# EasyEDA Pro project ProPrj_MN42_2025-04-03.epro, schematic btnBRD
Board Name: btnBRD; Create Date: 2025-04-03; Page Name: btnBRD; Project Name: MN42; Schematic Name: btnBRD; Update Date: 2025-04-03; File: btnBRD; Id: /; Sheet: /
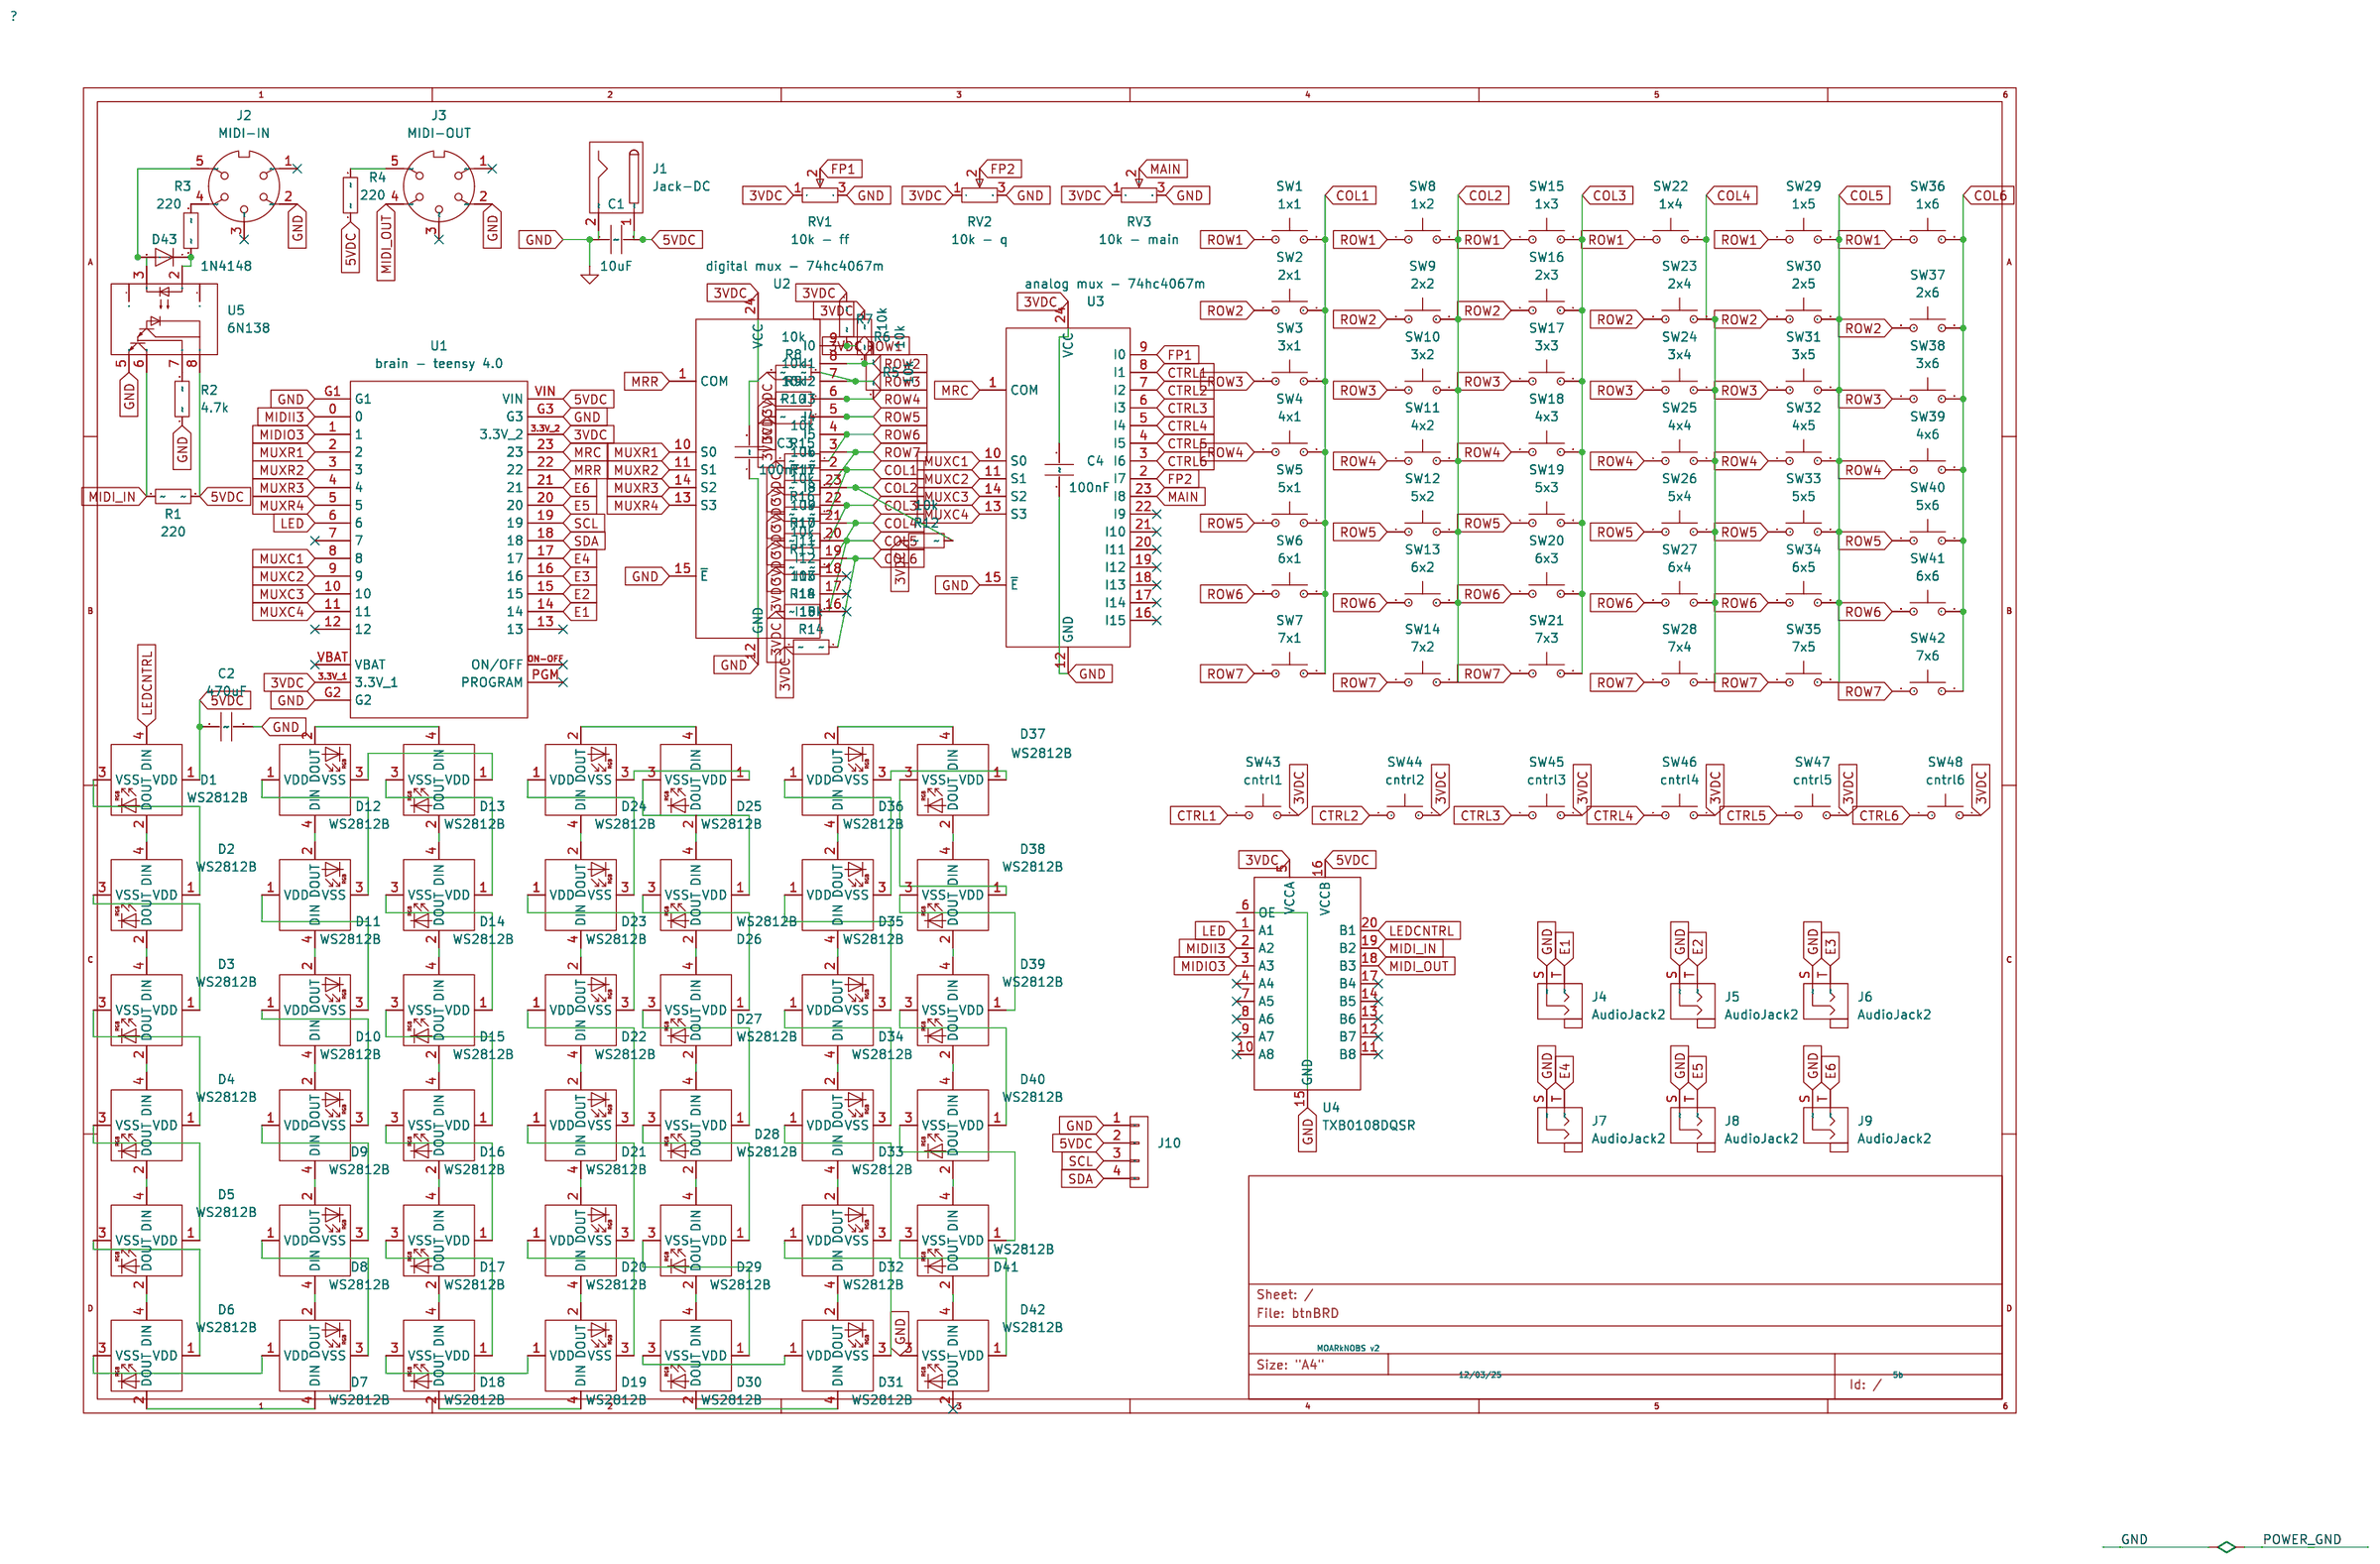
[diagram p0: schematic sheet]

## Parts
C1  10uF  [Capacitor_THT:C_Disc_D3.4mm_W2.1mm_P2.50mm]
C2  470uF  [Capacitor_THT:C_Disc_D3.4mm_W2.1mm_P2.50mm]
C3  100nF  [Capacitor_THT:C_Disc_D3.4mm_W2.1mm_P2.50mm]
C4  100nF  [Capacitor_THT:C_Disc_D3.4mm_W2.1mm_P2.50mm]
D1  WS2812B  [LED_SMD:LED_WS2812B_PLCC4_5.0x5.0mm_P3.2mm]
D2  WS2812B  [LED_SMD:LED_WS2812B_PLCC4_5.0x5.0mm_P3.2mm]
D3  WS2812B  [LED_SMD:LED_WS2812B_PLCC4_5.0x5.0mm_P3.2mm]
D4  WS2812B  [LED_SMD:LED_WS2812B_PLCC4_5.0x5.0mm_P3.2mm]
D5  WS2812B  [LED_SMD:LED_WS2812B_PLCC4_5.0x5.0mm_P3.2mm]
D6  WS2812B  [LED_SMD:LED_WS2812B_PLCC4_5.0x5.0mm_P3.2mm]
D7  WS2812B  [LED_SMD:LED_WS2812B_PLCC4_5.0x5.0mm_P3.2mm]
D8  WS2812B  [LED_SMD:LED_WS2812B_PLCC4_5.0x5.0mm_P3.2mm]
D9  WS2812B  [LED_SMD:LED_WS2812B_PLCC4_5.0x5.0mm_P3.2mm]
D10  WS2812B  [LED_SMD:LED_WS2812B_PLCC4_5.0x5.0mm_P3.2mm]
D11  WS2812B  [LED_SMD:LED_WS2812B_PLCC4_5.0x5.0mm_P3.2mm]
D12  WS2812B  [LED_SMD:LED_WS2812B_PLCC4_5.0x5.0mm_P3.2mm]
D13  WS2812B  [LED_SMD:LED_WS2812B_PLCC4_5.0x5.0mm_P3.2mm]
D14  WS2812B  [LED_SMD:LED_WS2812B_PLCC4_5.0x5.0mm_P3.2mm]
D15  WS2812B  [LED_SMD:LED_WS2812B_PLCC4_5.0x5.0mm_P3.2mm]
D16  WS2812B  [LED_SMD:LED_WS2812B_PLCC4_5.0x5.0mm_P3.2mm]
D17  WS2812B  [LED_SMD:LED_WS2812B_PLCC4_5.0x5.0mm_P3.2mm]
D18  WS2812B  [LED_SMD:LED_WS2812B_PLCC4_5.0x5.0mm_P3.2mm]
D19  WS2812B  [LED_SMD:LED_WS2812B_PLCC4_5.0x5.0mm_P3.2mm]
D20  WS2812B  [LED_SMD:LED_WS2812B_PLCC4_5.0x5.0mm_P3.2mm]
D21  WS2812B  [LED_SMD:LED_WS2812B_PLCC4_5.0x5.0mm_P3.2mm]
D22  WS2812B  [LED_SMD:LED_WS2812B_PLCC4_5.0x5.0mm_P3.2mm]
D23  WS2812B  [LED_SMD:LED_WS2812B_PLCC4_5.0x5.0mm_P3.2mm]
D24  WS2812B  [LED_SMD:LED_WS2812B_PLCC4_5.0x5.0mm_P3.2mm]
D25  WS2812B  [LED_SMD:LED_WS2812B_PLCC4_5.0x5.0mm_P3.2mm]
D26  WS2812B  [LED_SMD:LED_WS2812B_PLCC4_5.0x5.0mm_P3.2mm]
D27  WS2812B  [LED_SMD:LED_WS2812B_PLCC4_5.0x5.0mm_P3.2mm]
D28  WS2812B  [LED_SMD:LED_WS2812B_PLCC4_5.0x5.0mm_P3.2mm]
D29  WS2812B  [LED_SMD:LED_WS2812B_PLCC4_5.0x5.0mm_P3.2mm]
D30  WS2812B  [LED_SMD:LED_WS2812B_PLCC4_5.0x5.0mm_P3.2mm]
D31  WS2812B  [LED_SMD:LED_WS2812B_PLCC4_5.0x5.0mm_P3.2mm]
D32  WS2812B  [LED_SMD:LED_WS2812B_PLCC4_5.0x5.0mm_P3.2mm]
D33  WS2812B  [LED_SMD:LED_WS2812B_PLCC4_5.0x5.0mm_P3.2mm]
D34  WS2812B  [LED_SMD:LED_WS2812B_PLCC4_5.0x5.0mm_P3.2mm]
D35  WS2812B  [LED_SMD:LED_WS2812B_PLCC4_5.0x5.0mm_P3.2mm]
D36  WS2812B  [LED_SMD:LED_WS2812B_PLCC4_5.0x5.0mm_P3.2mm]
D37  WS2812B  [LED_SMD:LED_WS2812B_PLCC4_5.0x5.0mm_P3.2mm]
D38  WS2812B  [LED_SMD:LED_WS2812B_PLCC4_5.0x5.0mm_P3.2mm]
D39  WS2812B  [LED_SMD:LED_WS2812B_PLCC4_5.0x5.0mm_P3.2mm]
D40  WS2812B  [LED_SMD:LED_WS2812B_PLCC4_5.0x5.0mm_P3.2mm]
D41  WS2812B  [LED_SMD:LED_WS2812B_PLCC4_5.0x5.0mm_P3.2mm]
D42  WS2812B  [LED_SMD:LED_WS2812B_PLCC4_5.0x5.0mm_P3.2mm]
D43  1N4148  [Diode_THT:D_DO-35_SOD27_P7.62mm_Horizontal]
J1  Jack-DC  [Connector_BarrelJack:BarrelJack_GCT_DCJ200-10-A_Horizontal]
J2  MIDI-IN  [midiJack:KYCON_KCDX-5S-N]
J3  MIDI-OUT  [midiJack:KYCON_KCDX-5S-N]
J4  AudioJack2  [Connector_Audio:Jack_3.5mm_CUI_SJ1-3533NG_Horizontal]
J5  AudioJack2  [Connector_Audio:Jack_3.5mm_CUI_SJ1-3533NG_Horizontal]
J6  AudioJack2  [Connector_Audio:Jack_3.5mm_CUI_SJ1-3533NG_Horizontal]
J7  AudioJack2  [Connector_Audio:Jack_3.5mm_CUI_SJ1-3533NG_Horizontal]
J8  AudioJack2  [Connector_Audio:Jack_3.5mm_CUI_SJ1-3533NG_Horizontal]
J9  AudioJack2  [Connector_Audio:Jack_3.5mm_CUI_SJ1-3533NG_Horizontal]
J10  HS96L03W2C03  [OLED-TH_L27.8-W27.2-P2.54_C9900033791]
R1  220  [Resistor_THT:R_Axial_DIN0204_L3.6mm_D1.6mm_P2.54mm_Vertical]
R2  4.7k  [Resistor_THT:R_Axial_DIN0204_L3.6mm_D1.6mm_P2.54mm_Vertical]
R3  220  [Resistor_THT:R_Axial_DIN0204_L3.6mm_D1.6mm_P2.54mm_Vertical]
R4  220  [Resistor_THT:R_Axial_DIN0204_L3.6mm_D1.6mm_P2.54mm_Vertical]
R5  10k  [Resistor_THT:R_Axial_DIN0204_L3.6mm_D1.6mm_P2.54mm_Vertical]
R6  10k  [Resistor_THT:R_Axial_DIN0204_L3.6mm_D1.6mm_P2.54mm_Vertical]
R7  10k  [Resistor_THT:R_Axial_DIN0204_L3.6mm_D1.6mm_P2.54mm_Vertical]
R8  10k  [Resistor_THT:R_Axial_DIN0204_L3.6mm_D1.6mm_P2.54mm_Vertical]
R9  10k  [Resistor_THT:R_Axial_DIN0204_L3.6mm_D1.6mm_P2.54mm_Vertical]
R10  10k  [Resistor_THT:R_Axial_DIN0204_L3.6mm_D1.6mm_P2.54mm_Vertical]
R11  10k  [Resistor_THT:R_Axial_DIN0204_L3.6mm_D1.6mm_P2.54mm_Vertical]
R12  10k  [Resistor_THT:R_Axial_DIN0204_L3.6mm_D1.6mm_P2.54mm_Vertical]
R13  10k  [Resistor_THT:R_Axial_DIN0204_L3.6mm_D1.6mm_P2.54mm_Vertical]
R14  10k  [Resistor_THT:R_Axial_DIN0204_L3.6mm_D1.6mm_P2.54mm_Vertical]
R15  10k  [Resistor_THT:R_Axial_DIN0204_L3.6mm_D1.6mm_P2.54mm_Vertical]
R16  10k  [Resistor_THT:R_Axial_DIN0204_L3.6mm_D1.6mm_P2.54mm_Vertical]
R17  10k  [Resistor_THT:R_Axial_DIN0204_L3.6mm_D1.6mm_P2.54mm_Vertical]
R18  10k  [Resistor_THT:R_Axial_DIN0204_L3.6mm_D1.6mm_P2.54mm_Vertical]
RV1  10k - ff  [Potentiometer_THT:Potentiometer_Alps_RK09L_Single_Vertical]
RV2  10k - q  [Potentiometer_THT:Potentiometer_Alps_RK09L_Single_Vertical]
RV3  10k - main  [Potentiometer_THT:Potentiometer_Alps_RK09L_Single_Vertical]
SW1  1x1  [Button_Switch_SMD:SW_SPST_PTS645]
SW2  2x1  [Button_Switch_SMD:SW_SPST_PTS645]
SW3  3x1  [Button_Switch_SMD:SW_SPST_PTS645]
SW4  4x1  [Button_Switch_SMD:SW_SPST_PTS645]
SW5  5x1  [Button_Switch_SMD:SW_SPST_PTS645]
SW6  6x1  [Button_Switch_SMD:SW_SPST_PTS645]
SW7  7x1  [Button_Switch_SMD:SW_SPST_PTS645]
SW8  1x2  [Button_Switch_SMD:SW_SPST_PTS645]
SW9  2x2  [Button_Switch_SMD:SW_SPST_PTS645]
SW10  3x2  [Button_Switch_SMD:SW_SPST_PTS645]
SW11  4x2  [Button_Switch_SMD:SW_SPST_PTS645]
SW12  5x2  [Button_Switch_SMD:SW_SPST_PTS645]
SW13  6x2  [Button_Switch_SMD:SW_SPST_PTS645]
SW14  7x2  [Button_Switch_SMD:SW_SPST_PTS645]
SW15  1x3  [Button_Switch_SMD:SW_SPST_PTS645]
SW16  2x3  [Button_Switch_SMD:SW_SPST_PTS645]
SW17  3x3  [Button_Switch_SMD:SW_SPST_PTS645]
SW18  4x3  [Button_Switch_SMD:SW_SPST_PTS645]
SW19  5x3  [Button_Switch_SMD:SW_SPST_PTS645]
SW20  6x3  [Button_Switch_SMD:SW_SPST_PTS645]
SW21  7x3  [Button_Switch_SMD:SW_SPST_PTS645]
SW22  1x4  [Button_Switch_SMD:SW_SPST_PTS645]
SW23  2x4  [Button_Switch_SMD:SW_SPST_PTS645]
SW24  3x4  [Button_Switch_SMD:SW_SPST_PTS645]
SW25  4x4  [Button_Switch_SMD:SW_SPST_PTS645]
SW26  5x4  [Button_Switch_SMD:SW_SPST_PTS645]
SW27  6x4  [Button_Switch_SMD:SW_SPST_PTS645]
SW28  7x4  [Button_Switch_SMD:SW_SPST_PTS645]
SW29  1x5  [Button_Switch_SMD:SW_SPST_PTS645]
SW30  2x5  [Button_Switch_SMD:SW_SPST_PTS645]
SW31  3x5  [Button_Switch_SMD:SW_SPST_PTS645]
SW32  4x5  [Button_Switch_SMD:SW_SPST_PTS645]
SW33  5x5  [Button_Switch_SMD:SW_SPST_PTS645]
SW34  6x5  [Button_Switch_SMD:SW_SPST_PTS645]
SW35  7x5  [Button_Switch_SMD:SW_SPST_PTS645]
SW36  1x6  [Button_Switch_SMD:SW_SPST_PTS645]
SW37  2x6  [Button_Switch_SMD:SW_SPST_PTS645]
SW38  3x6  [Button_Switch_SMD:SW_SPST_PTS645]
SW39  4x6  [Button_Switch_SMD:SW_SPST_PTS645]
SW40  5x6  [Button_Switch_SMD:SW_SPST_PTS645]
SW41  6x6  [Button_Switch_SMD:SW_SPST_PTS645]
SW42  7x6  [Button_Switch_SMD:SW_SPST_PTS645]
SW43  cntrl1  [Button_Switch_SMD:SW_SPST_PTS645]
SW44  cntrl2  [Button_Switch_SMD:SW_SPST_PTS645]
SW45  cntrl3  [Button_Switch_SMD:SW_SPST_PTS645]
SW46  cntrl4  [Button_Switch_SMD:SW_SPST_PTS645]
SW47  cntrl5  [Button_Switch_SMD:SW_SPST_PTS645]
SW48  cntrl6  [Button_Switch_SMD:SW_SPST_PTS645]
U1  brain - teensy 4.0  [teensy 4.0:MODULE_DEV-15583]
U2  digital mux - 74hc4067m  [Package_SO:SOIC-24W_7.5x15.4mm_P1.27mm]
U3  analog mux - 74hc4067m  [Package_SO:SOIC-24W_7.5x15.4mm_P1.27mm]
U4  TXB0108DQSR  [Package_SON:USON-20_2x4mm_P0.4mm]
U5  6N138  [Package_DIP:DIP-8_W7.62mm]

## Library data of the parts
C1-C4 = Device_C
D1-D42 = LED_WS2812B: User doc link: https://cdn-shop.adafruit.com/datasheets/WS2812B.pdf
D43 = Diode_1N4148: User doc link: https://assets.nexperia.com/documents/data-sheet/1N4148_1N4448.pdf
J1 = Connector_Jack-DC
J2 J3 = Connector_DIN-5: User doc link: http://www.mouser.com/ds/2/18/40_c091_abd_e-75918.pdf
J4-J9 = Connector_AudioJack2
J10 = HS96L03W2C03: Main Control Chip:SSD1315 Interface Type:I2C Size:0.96 Pixel Resolution:128x64 Operating Temperature:-40℃~+70℃ Operating Temperature:-40℃~+70℃; LCSC Part Name: 0.96寸OLED显示屏窄白光IIC; Supplier Part: C5248080; Manufacturer: HS(汉昇); JLCPCB Part Class: Extended Part; Datasheet: https://atta.szlcsc.com/upload/public/pdf/source/20230627/763D01F79A90007632F098068C7C8AD9.pdf; Supplier: LCSC; Main Control Chip: SSD1315; Interface Type: I2C; Size: 0.96; Pixel Resolution: 128x64; Operating Temperature: -40℃~+70℃
R1-R18 = Device_R
RV1-RV3 = Device_R_Potentiometer
SW1-SW48 = Switch_SW_Push
U1 = teensy40_DEV-15583: STANDARD: Manufacturer Recommendations; MAXIMUM_PACKAGE_HEIGHT: 5.87mm; MANUFACTURER: Sparkfun
U2 U3 = 74xx_CD74HC4067M: User doc link: http://www.ti.com/lit/ds/symlink/cd74hc4067.pdf
U4 = Logic_LevelTranslator_TXB0108DQSR: User doc link: http://www.ti.com/lit/ds/symlink/txb0108.pdf
U5 = Isolator_6N138: User doc link: http://www.onsemi.com/pub/Collateral/HCPL2731-D.pdf

## Nets
3VDC: C3.2 C4.2 R5.2 R6.2 R7.2 R8.2 R9.2 R10.2 R11.2 R12.2 R13.2 R14.2 R15.2 R16.2 R17.2 R18.2 RV1.1 RV2.1 RV3.1 SW43.2 SW44.2 SW45.2 SW46.2 SW47.2 SW48.2 U1.3.3V_1 U1.3.3V_2 U2.24(VCC) U3.24(VCC) U4.5(VCCA)
5VDC: C1.2 C2.1 D1.1(VDD) J1.1 J10.2(Pin) R1.2 R4.1 U1.VIN U4.16(VCCB) U5.8(VCC)
COL1: R16.1 SW1.2 SW2.2 SW3.2 SW4.2 SW5.2 SW6.2 SW7.2 U2.2(I7)
COL2: R12.1 SW8.2 SW9.2 SW10.2 SW11.2 SW12.2 SW13.2 SW14.2 U2.23(I8)
COL3: R17.1 SW15.2 SW16.2 SW17.2 SW18.2 SW19.2 SW20.2 SW21.2 U2.22(I9)
COL4: R13.1 SW22.2 SW23.2 SW24.2 SW25.2 SW26.2 SW27.2 SW28.2 U2.21(I10)
COL5: R18.1 SW29.2 SW30.2 SW31.2 SW32.2 SW33.2 SW34.2 SW35.2 U2.20(I11)
COL6: R14.1 SW36.2 SW37.2 SW38.2 SW39.2 SW40.2 SW41.2 SW42.2 U2.19(I12)
CTRL1: SW43.1 U3.8(I1)
CTRL2: SW44.1 U3.7(I2)
CTRL3: SW45.1 U3.6(I3)
CTRL4: SW46.1 U3.5(I4)
CTRL5: SW47.1 U3.4(I5)
CTRL6: SW48.1 U3.3(I6)
E1: J4.T U1.14
E2: J5.T U1.15
E3: J6.T U1.16
E4: J7.T U1.17
E5: J8.T U1.20
E6: J9.T U1.21
FP1: RV1.2 U3.9(I0)
FP2: RV2.2 U3.2(I7)
LED: U1.6 U4.1(A1)
LEDCNTRL: D1.4(DIN) U4.20(B1)
MAIN: RV3.2 U3.23(I8)
MIDI_IN: R1.1 U4.19(B2) U5.6(VO2)
MIDI_OUT: J3.4 U4.18(B3)
MIDII3: U1.0 U4.2(A2)
MIDIO3: U1.1 U4.3(A3)
MRC: U1.23 U3.1(COM)
MRR: U1.22 U2.1(COM)
MUXC1: U1.8 U3.10(S0)
MUXC2: U1.9 U3.11(S1)
MUXC3: U1.10 U3.14(S2)
MUXC4: U1.11 U3.13(S3)
MUXR1: U1.2 U2.10(S0)
MUXR2: U1.3 U2.11(S1)
MUXR3: U1.4 U2.14(S2)
MUXR4: U1.5 U2.13(S3)
POWER_GND: C1.1 C2.2 C3.1 C4.1 D42.3(VSS) J1.2 J2.2 J3.2 J4.S J5.S J6.S J7.S J8.S J9.S J10.1(Pin) R2.1 RV1.3 RV2.3 RV3.3 U1.G1 U1.G2 U1.G3 U2.12(GND) U2.15(~{E}) U3.12(GND) U3.15(~{E}) U4.6(OE) U4.15(GND) U5.5(GND)
ROW1: R7.1 SW1.1 SW8.1 SW15.1 SW22.1 SW29.1 SW36.1 U2.9(I0)
ROW2: R6.1 SW2.1 SW9.1 SW16.1 SW23.1 SW30.1 SW37.1 U2.8(I1)
ROW3: R8.1 SW3.1 SW10.1 SW17.1 SW24.1 SW31.1 SW38.1 U2.7(I2)
ROW4: R5.1 R9.1 SW4.1 SW11.1 SW18.1 SW25.1 SW32.1 SW39.1 U2.6(I3)
ROW5: R10.1 SW5.1 SW12.1 SW19.1 SW26.1 SW33.1 SW40.1 U2.5(I4)
ROW6: R15.1 SW6.1 SW13.1 SW20.1 SW27.1 SW34.1 SW41.1 U2.4(I5)
ROW7: R11.1 SW7.1 SW14.1 SW21.1 SW28.1 SW35.1 SW42.1 U2.3(I6)
SCL: J10.3(Pin) U1.19
SDA: J10.4(Pin) U1.18
$1N1: D35.2(DOUT) D36.4(DIN)
$1N4: D15.2(DOUT) D16.4(DIN)
$1N5: D26.3(VSS) D27.1(VDD)
$1N6: D43.1(K) R3.1 U5.2(C1)
$1N7: D29.3(VSS) D30.1(VDD)
$1N8: D4.3(VSS) D5.1(VDD)
$1N11: D23.3(VSS) D24.1(VDD)
$1N12: D3.3(VSS) D4.1(VDD)
$1N13: D22.2(DOUT) D23.4(DIN)
$1N15: D36.3(VSS) D37.1(VDD)
$1N17: D11.3(VSS) D12.1(VDD)
$1N19: D31.3(VSS) D32.1(VDD)
$1N20: D18.3(VSS) D19.1(VDD)
$1N23: D34.2(DOUT) D35.4(DIN)
$1N24: J3.5 R4.2
$1N25: D10.3(VSS) D11.1(VDD)
$1N26: D20.3(VSS) D21.1(VDD)
$1N27: D38.3(VSS) D39.1(VDD)
$1N29: D17.3(VSS) D18.1(VDD)
$1N30: D7.3(VSS) D8.1(VDD)
$1N31: D9.3(VSS) D10.1(VDD)
$1N32: D13.2(DOUT) D14.4(DIN)
$1N33: D32.3(VSS) D33.1(VDD)
$1N34: D15.3(VSS) D16.1(VDD)
$1N37: D5.3(VSS) D6.1(VDD)
$1N38: D19.2(DOUT) D20.4(DIN)
$1N39: D20.2(DOUT) D21.4(DIN)
$1N40: D35.3(VSS) D36.1(VDD)
$1N43: D24.3(VSS) D25.1(VDD)
$1N45: D21.2(DOUT) D22.4(DIN)
$1N46: D32.2(DOUT) D33.4(DIN)
$1N51: D12.2(DOUT) D13.4(DIN)
$1N54: D6.3(VSS) D7.1(VDD)
$1N56: D14.2(DOUT) D15.4(DIN)
$1N57: D36.2(DOUT) D37.4(DIN)
$1N58: D8.3(VSS) D9.1(VDD)
$1N59: D40.3(VSS) D41.1(VDD)
$1N60: D13.3(VSS) D14.1(VDD)
$1N61: D7.2(DOUT) D8.4(DIN)
$1N62: D33.3(VSS) D34.1(VDD)
$1N63: D41.3(VSS) D42.1(VDD)
$1N64: D25.3(VSS) D26.1(VDD)
$1N65: D30.3(VSS) D31.1(VDD)
$1N66: D33.2(DOUT) D34.4(DIN)
$1N68: D16.3(VSS) D17.1(VDD)
$1N70: D21.3(VSS) D22.1(VDD)
$1N71: D2.3(VSS) D3.1(VDD)
$1N74: D1.3(VSS) D2.1(VDD)
$1N75: D31.2(DOUT) D32.4(DIN)
$1N78: D2.2(DOUT) D3.4(DIN)
$1N79: D27.3(VSS) D28.1(VDD)
$1N82: D34.3(VSS) D35.1(VDD)
$1N90: D28.2(DOUT) D29.4(DIN)
$1N92: D19.3(VSS) D20.1(VDD)
$1N93: D17.2(DOUT) D18.4(DIN)
$1N94: D25.2(DOUT) D26.4(DIN)
$1N96: D37.3(VSS) D38.1(VDD)
$1N97: D43.2(A) J2.5 U5.3(C2)
$1N107: D22.3(VSS) D23.1(VDD)
$1N108: D39.3(VSS) D40.1(VDD)
$1N112: D3.2(DOUT) D4.4(DIN)
$1N121: D26.2(DOUT) D27.4(DIN)
$1N123: D12.3(VSS) D13.1(VDD)
$1N124: D4.2(DOUT) D5.4(DIN)
$1N125: D29.2(DOUT) D30.4(DIN)
$1N126: D39.2(DOUT) D40.4(DIN)
$1N127: D18.2(DOUT) D19.4(DIN)
$1N128: D5.2(DOUT) D6.4(DIN)
$1N131: D11.2(DOUT) D12.4(DIN)
$1N132: D14.3(VSS) D15.1(VDD)
$1N133: D23.2(DOUT) D24.4(DIN)
$1N134: D30.2(DOUT) D31.4(DIN)
$1N136: D27.2(DOUT) D28.4(DIN)
$1N138: D28.3(VSS) D29.1(VDD)
$1N139: D8.2(DOUT) D9.4(DIN)
$1N141: D6.2(DOUT) D7.4(DIN)
$1N142: D37.2(DOUT) D38.4(DIN)
$1N144: D41.2(DOUT) D42.4(DIN)
$1N145: D40.2(DOUT) D41.4(DIN)
$1N146: D16.2(DOUT) D17.4(DIN)
$1N147: D1.2(DOUT) D2.4(DIN)
$1N148: D9.2(DOUT) D10.4(DIN)
$1N149: D38.2(DOUT) D39.4(DIN)
$1N151: D10.2(DOUT) D11.4(DIN)
$1N152: D24.2(DOUT) D25.4(DIN)
$1N2399: R2.2 U5.7(VO1)
$1N2400: J2.4 R3.2

Not connected (* = marked no-connect by the designer): D42 2(DOUT)*; J2 1* 3*; J3 1* 3*; U1 7* 12* 13* ON-OFF(ON/OFF)* PGM(PROGRAM)* VBAT*; U2 16(I15)* 17(I14)* 18(I13)*; U3 16(I15)* 17(I14)* 18(I13)* 19(I12)* 20(I11)* 21(I10)* 22(I9)*; U4 4(A4)* 7(A5)* 8(A6)* 9(A7)* 10(A8)* 11(B8)* 12(B7)* 13(B6)* 14(B5)* 17(B4)*; U5 1(NC) 4(NC)

## Notes on the sheet
- MOARkNOBS v2
- 12/03/25
- 5b
